# Altium schematic sheet 00 - Main.SchDoc
size A4
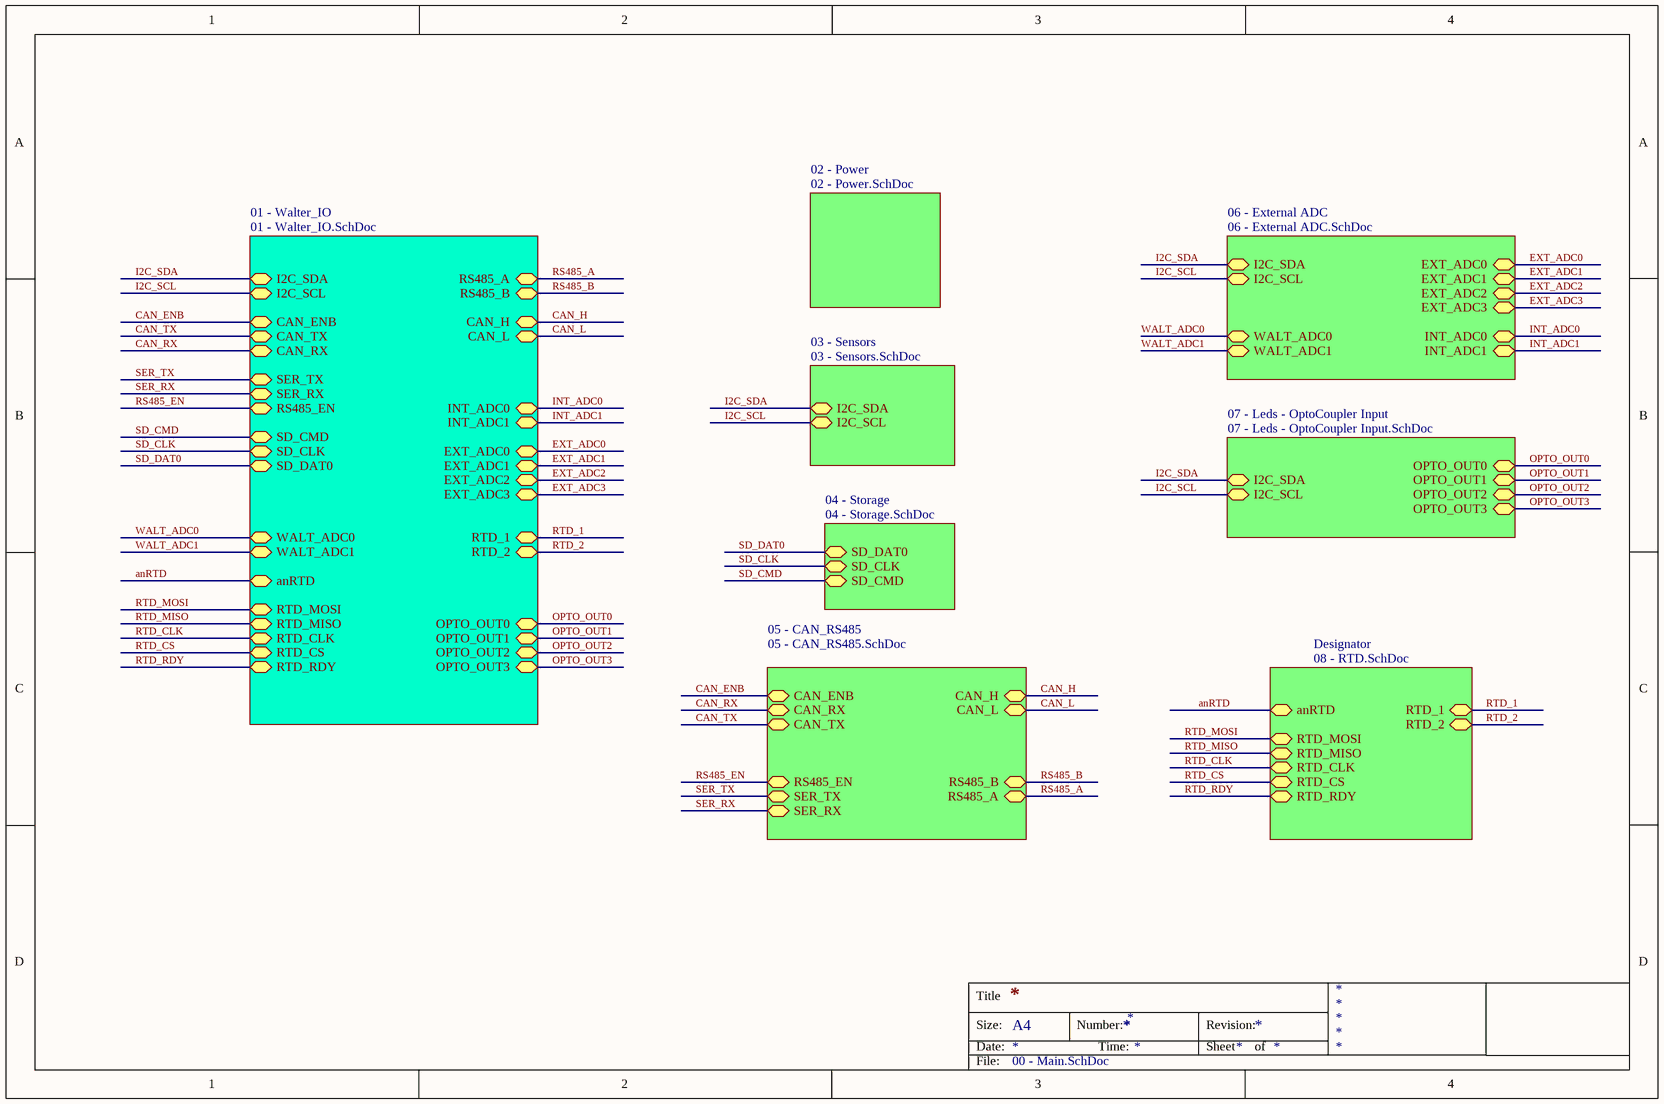
[diagram p0: 00 - Main.SchDoc]

## Sub-sheets
01 - Walter_IO = 01 - Walter_IO.SchDoc: CAN_L (bidir), CAN_H (bidir), INT_ADC1 (bidir), WALT_ADC0 (bidir), EXT_ADC3 (bidir), INT_ADC0 (bidir), I2C_SDA (bidir), RS485_B (bidir), SD_DAT0 (bidir), RS485_A (bidir), I2C_SCL (bidir), SER_TX (bidir), SD_CMD (bidir), SD_CLK (bidir), SER_RX (bidir), EXT_ADC2 (bidir), EXT_ADC1 (bidir), CAN_RX (bidir), CAN_TX (bidir), RS485_EN (bidir), EXT_ADC0 (bidir), OPTO_OUT3 (bidir), RTD_MISO (bidir), RTD_2 (bidir), OPTO_OUT1 (bidir), RTD_RDY (bidir), OPTO_OUT0 (bidir), RTD_MOSI (bidir), RTD_CLK (bidir), WALT_ADC1 (bidir), OPTO_OUT2 (bidir), RTD_1 (bidir), RTD_CS (bidir), anRTD (bidir), CAN_ENB (bidir)
02 - Power = 02 - Power.SchDoc: no entries
03 - Sensors = 03 - Sensors.SchDoc: I2C_SCL (bidir), I2C_SDA (bidir)
04 - Storage = 04 - Storage.SchDoc: SD_DAT0 (bidir), SD_CLK (bidir), SD_CMD (bidir)
05 - CAN_RS485 = 05 - CAN_RS485.SchDoc: CAN_H (bidir), CAN_L (bidir), SER_TX (bidir), SER_RX (bidir), RS485_A (bidir), CAN_TX (bidir), CAN_RX (bidir), RS485_B (bidir), RS485_EN (bidir), CAN_ENB (bidir)
06 - External ADC = 06 - External ADC.SchDoc: I2C_SDA (bidir), I2C_SCL (bidir), WALT_ADC0 (bidir), EXT_ADC0 (bidir), EXT_ADC1 (bidir), INT_ADC0 (bidir), EXT_ADC2 (bidir), EXT_ADC3 (bidir), INT_ADC1 (bidir), WALT_ADC1 (bidir)
07 - Leds - OptoCoupler Input = 07 - Leds - OptoCoupler Input.SchDoc: OPTO_OUT1 (bidir), OPTO_OUT3 (bidir), OPTO_OUT2 (bidir), OPTO_OUT0 (bidir), I2C_SDA (bidir), I2C_SCL (bidir)
Designator = 08 - RTD.SchDoc: anRTD (bidir), RTD_1 (bidir), RTD_MISO (bidir), RTD_CLK (bidir), RTD_CS (bidir), RTD_RDY (bidir), RTD_2 (bidir), RTD_MOSI (bidir)

## Nets
anRTD: sheet Designator/anRTD, sheet 01 - Walter_IO/anRTD
CAN_ENB: sheet 05 - CAN_RS485/CAN_ENB, sheet 01 - Walter_IO/CAN_ENB
CAN_H: sheet 05 - CAN_RS485/CAN_H, sheet 01 - Walter_IO/CAN_H
CAN_L: sheet 05 - CAN_RS485/CAN_L, sheet 01 - Walter_IO/CAN_L
CAN_RX: sheet 05 - CAN_RS485/CAN_RX, sheet 01 - Walter_IO/CAN_RX
CAN_TX: sheet 05 - CAN_RS485/CAN_TX, sheet 01 - Walter_IO/CAN_TX
EXT_ADC0: sheet 06 - External ADC/EXT_ADC0, sheet 01 - Walter_IO/EXT_ADC0
EXT_ADC1: sheet 06 - External ADC/EXT_ADC1, sheet 01 - Walter_IO/EXT_ADC1
EXT_ADC2: sheet 06 - External ADC/EXT_ADC2, sheet 01 - Walter_IO/EXT_ADC2
EXT_ADC3: sheet 06 - External ADC/EXT_ADC3, sheet 01 - Walter_IO/EXT_ADC3
I2C_SCL: sheet 03 - Sensors/I2C_SCL, sheet 06 - External ADC/I2C_SCL, sheet 07 - Leds - OptoCoupler Input/I2C_SCL, sheet 01 - Walter_IO/I2C_SCL
I2C_SDA: sheet 03 - Sensors/I2C_SDA, sheet 06 - External ADC/I2C_SDA, sheet 07 - Leds - OptoCoupler Input/I2C_SDA, sheet 01 - Walter_IO/I2C_SDA
INT_ADC0: sheet 06 - External ADC/INT_ADC0, sheet 01 - Walter_IO/INT_ADC0
INT_ADC1: sheet 06 - External ADC/INT_ADC1, sheet 01 - Walter_IO/INT_ADC1
OPTO_OUT0: sheet 07 - Leds - OptoCoupler Input/OPTO_OUT0, sheet 01 - Walter_IO/OPTO_OUT0
OPTO_OUT1: sheet 07 - Leds - OptoCoupler Input/OPTO_OUT1, sheet 01 - Walter_IO/OPTO_OUT1
OPTO_OUT2: sheet 07 - Leds - OptoCoupler Input/OPTO_OUT2, sheet 01 - Walter_IO/OPTO_OUT2
OPTO_OUT3: sheet 07 - Leds - OptoCoupler Input/OPTO_OUT3, sheet 01 - Walter_IO/OPTO_OUT3
RS485_A: sheet 05 - CAN_RS485/RS485_A, sheet 01 - Walter_IO/RS485_A
RS485_B: sheet 05 - CAN_RS485/RS485_B, sheet 01 - Walter_IO/RS485_B
RS485_EN: sheet 05 - CAN_RS485/RS485_EN, sheet 01 - Walter_IO/RS485_EN
RTD_1: sheet Designator/RTD_1, sheet 01 - Walter_IO/RTD_1
RTD_2: sheet Designator/RTD_2, sheet 01 - Walter_IO/RTD_2
RTD_CLK: sheet Designator/RTD_CLK, sheet 01 - Walter_IO/RTD_CLK
RTD_CS: sheet Designator/RTD_CS, sheet 01 - Walter_IO/RTD_CS
RTD_MISO: sheet Designator/RTD_MISO, sheet 01 - Walter_IO/RTD_MISO
RTD_MOSI: sheet Designator/RTD_MOSI, sheet 01 - Walter_IO/RTD_MOSI
RTD_RDY: sheet Designator/RTD_RDY, sheet 01 - Walter_IO/RTD_RDY
SD_CLK: sheet 04 - Storage/SD_CLK, sheet 01 - Walter_IO/SD_CLK
SD_CMD: sheet 04 - Storage/SD_CMD, sheet 01 - Walter_IO/SD_CMD
SD_DAT0: sheet 04 - Storage/SD_DAT0, sheet 01 - Walter_IO/SD_DAT0
SER_RX: sheet 05 - CAN_RS485/SER_RX, sheet 01 - Walter_IO/SER_RX
SER_TX: sheet 05 - CAN_RS485/SER_TX, sheet 01 - Walter_IO/SER_TX
WALT_ADC0: sheet 06 - External ADC/WALT_ADC0, sheet 01 - Walter_IO/WALT_ADC0
WALT_ADC1: sheet 06 - External ADC/WALT_ADC1, sheet 01 - Walter_IO/WALT_ADC1

## Notes on the sheet
- Title
- Size:
- Date:
- A4
- Number:
- Time:
- Revision:
- Sheet
- of
- File: